# EAGLE schematic Swarm Bot Overall (EAGLE 6.2)
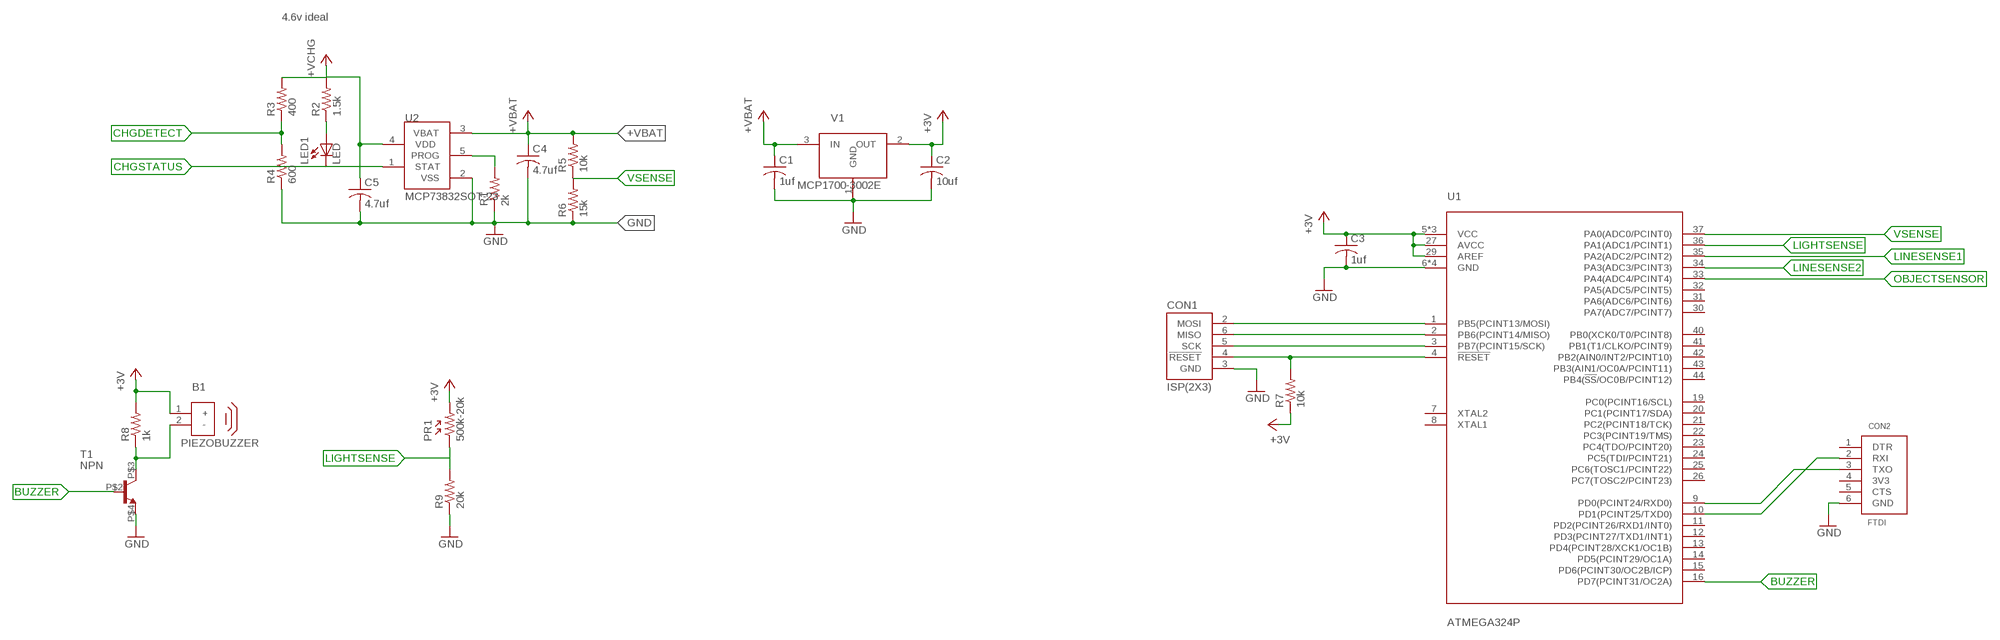
[diagram p0: schematic, sheet 1]

## Parts
B1  PIEZOBUZZER  [PIEZOBUZZER]
C1  1uf  CAP0603  [0603]
C2  10uf  CAP0805  [0805]
C3  1uf  CAP0603  [0603]
C4  4.7uf  CAP0603  [0603]
C5  4.7uf  CAP0603  [0603]
CON1  ISP(2X3)  [PINHEADER(2X3)]
CON2  FTDI  [PINHEADER(1X6)]
LED1  LED  [0603]
PR1  500k-20k  CDSPHOTORESISTOR  [CDSPHOTOCELL]
R1  2k  RES0603  [0603]
R2  1.5k  RES0603  [0603]
R3  400  RES0603  [0603]
R4  600  RES0603  [0603]
R5  10k  RES0603  [0603]
R6  15k  RES0603  [0603]
R7  10k  RES0603  [0603]
R8  1k  RES0603  [0603]
R9  20k  RES0603  [0603]
T1  NPN  [DUMMY]
U1  ATMEGA324P  [TQFP44]
U2  MCP73832SOT-23  [(OT)SOT-23(5PAD)]
V1  MCP1700-3002E  [(TT/NB)SOT-23(3PAD)]

## Nets
+3V: B1.1(+) C2.1 C3.1 PR1.2 R7.1 R8.2 U1.5(VCC) U1.17(VCC) U1.27(AVCC) U1.29(AREF) U1.38(VCC) V1.2(OUT)
+VBAT: C1.1 C4.1 R5.2 U2.3(VBAT) V1.3(IN)
+VCHG: C5.1 R2.2 R3.2 U2.4(VDD)
BUZZER: T1.P$2(B) U1.16(PD7(PCINT31/OC2A))
CHGDETECT: R3.1 R4.2
CHGSTATUS: LED1.1(C) U2.1(STAT)
GND: C1.2 C2.2 C3.2 C4.2 C5.2 CON1.3(GND) CON2.6(GND) R1.1 R4.1 R6.1 R9.1 T1.P$4(E) U1.6(GND) U1.18(GND) U1.28(GND) U1.39(GND) U2.2(VSS) V1.1(GND)
LIGHTSENSE: PR1.1 R9.2 U1.36(PA1(ADC1/PCINT1))
LINESENSE1: U1.35(PA2(ADC2/PCINT2))
LINESENSE2: U1.34(PA3(ADC3/PCINT3))
N$1: R1.2 U2.5(PROG)
N$2: CON1.2(MOSI) U1.1(PB5(PCINT13/MOSI))
N$3: CON1.6(MISO) U1.2(PB6(PCINT14/MISO))
N$4: LED1.2(A) R2.1
N$5: CON1.5(SCK) U1.3(PB7(PCINT15/SCK))
N$6: CON1.4(!RESET) R7.2 U1.4(!RESET)
N$7: CON2.2(RXI) U1.10(PD1(PCINT25/TXD0))
N$8: CON2.3(TXO) U1.9(PD0(PCINT24/RXD0))
N$9: B1.2(-) R8.1 T1.P$3(C)
OBJECTSENSOR: U1.33(PA4(ADC4/PCINT4))
VSENSE: R5.1 R6.2 U1.37(PA0(ADC0/PCINT0))
Unconnected: CON2.1(DTR) CON2.4(3V3) CON2.5(CTS) U1.7(XTAL2) U1.8(XTAL1) U1.11(PD2(PCINT26/RXD1/INT0)) U1.12(PD3(PCINT27/TXD1/INT1)) U1.13(PD4(PCINT28/XCK1/OC1B)) U1.14(PD5(PCINT29/OC1A)) U1.15(PD6(PCINT30/OC2B/ICP)) U1.19(PC0(PCINT16/SCL)) U1.20(PC1(PCINT17/SDA)) U1.21(PC2(PCINT18/TCK)) U1.22(PC3(PCINT19/TMS)) U1.23(PC4(TDO/PCINT20)) U1.24(PC5(TDI/PCINT21)) U1.25(PC6(TOSC1/PCINT22)) U1.26(PC7(TOSC2/PCINT23)) U1.30(PA7(ADC7/PCINT7)) U1.31(PA6(ADC6/PCINT6)) U1.32(PA5(ADC5/PCINT5)) U1.40(PB0(XCK0/T0/PCINT8)) U1.41(PB1(T1/CLKO/PCINT9)) U1.42(PB2(AIN0/INT2/PCINT10)) U1.43(PB3(AIN1/OC0A/PCINT11)) U1.44(PB4(!SS!/OC0B/PCINT12))

## Notes on the sheet
- 4.6v ideal

## Library data of the parts
B1 = Passive:PIEZOBUZZER: Digikey Part Number: 445-2525-1-ND Manufacturer Part Number: PS1240P02BT
C1-C5 = Passive:CAP
CON1 = Mechanical:ISP
CON2 = Mechanical:FTDI
LED1 = Passive:LED
PR1 = Passive:CDSPHOTORESISTOR
R1-R9 = Passive:RES
T1 = Passive:NPN
U1 = DigitalIC:ATMEGA324P: Digikey Part Number: ATMEGA324P-20AU-ND Manufacturer Part Number: ATMEGA324P-20AU
U2 = PowerIC:MCP73832: Digikey Part Number: MCP73832T-2ACI/OTCT-ND Manufacturer Part Number: MCP73832T-2ACI/OT
V1 = PowerIC:MCP1700-3002E: Digikey Part Number: MCP1700T-3002E/TTCT-ND Manufacturer Part Number: MCP1700T-3002E/TT